# Altium schematic sheet IMUs.SchDoc
size A; SheetNumber: 10; SheetTotal: 11
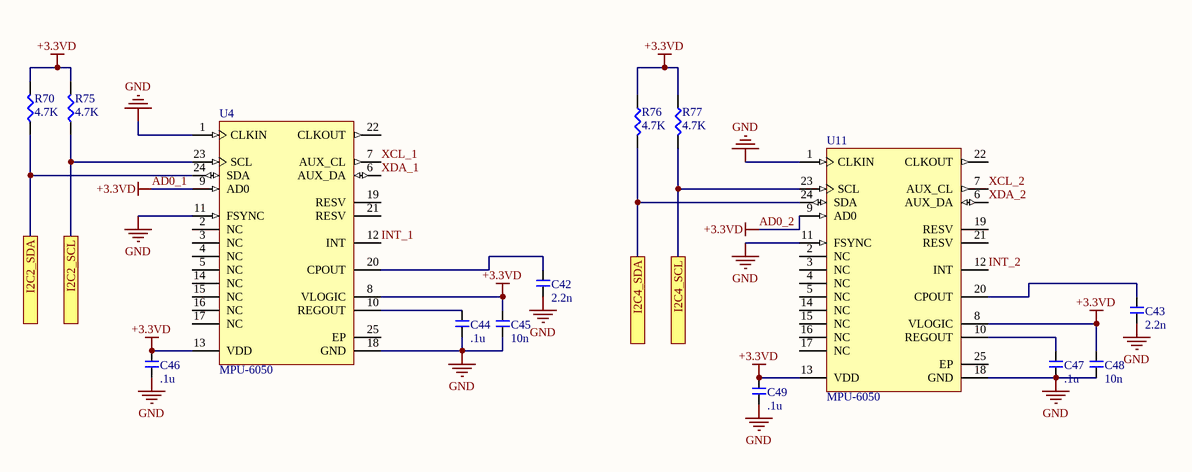
[diagram p0: IMUs.SchDoc]

## Parts
C42  2.2n  [CAP-0603]
C43  2.2n  [CAP-0603]
C44  .1u  [CAP-0603]
C45  10n  [CAP-0603]
C46  .1u  [CAP-0603]
C47  .1u  [CAP-0603]
C48  10n  [CAP-0603]
C49  .1u  [CAP-0603]
R70  4.7K  [RES-0603]
R75  4.7K  [RES-0603]
R76  4.7K  [RES-0603]
R77  4.7K  [RES-0603]
U4  MPU-6050  [IS-QFN-24_V]
U11  MPU-6050  [IS-QFN-24_V]

## Ports
I2C2_SCL, I2C2_SDA, I2C4_SCL, I2C4_SDA

## Nets
AD0_1: C45.2 C46.2 C48.2 C49.2 R70.2 R75.2 R76.1 R77.1 U4.8(VLOGIC) U4.9(AD0) U4.13(VDD) U11.8(VLOGIC) U11.9(AD0) U11.13(VDD)  [also labelled +3.3VD, AD0_2]
GND: C42.1 C43.1 C44.1 C45.1 C46.1 C47.1 C48.1 C49.1 U4.1(CLKIN) U4.11(FSYNC) U4.18(GND) U11.1(CLKIN) U11.11(FSYNC) U11.18(GND)
I2C2_SCL: R75.1 U4.23(SCL) ; port I2C2_SCL
I2C2_SDA: R70.1 U4.24(SDA) ; port I2C2_SDA
I2C4_SCL: R77.2 U11.23(SCL) ; port I2C4_SCL
I2C4_SDA: R76.2 U11.24(SDA) ; port I2C4_SDA
INT_1: U4.12(INT)
INT_2: U11.12(INT)
XCL_1: U4.7(AUX_CL)
XCL_2: U11.7(AUX_CL)
XDA_1: U4.6(AUX_DA)
XDA_2: U11.6(AUX_DA)
NetC42_2: C42.2 U4.20(CPOUT)
NetC43_2: C43.2 U11.20(CPOUT)
NetC44_2: C44.2 U4.10(REGOUT)
NetC47_2: C47.2 U11.10(REGOUT)

Not connected (* = marked no-connect by the designer): U4 2(NC) 3(NC) 4(NC) 5(NC) 14(NC) 15(NC) 16(NC) 17(NC) 19(RESV) 21(RESV) 22(CLKOUT) 25(EP); U11 2(NC) 3(NC) 4(NC) 5(NC) 14(NC) 15(NC) 16(NC) 17(NC) 19(RESV) 21(RESV) 22(CLKOUT) 25(EP)

## Library data of the parts
C42-C49 = CAP-0603
R70 R75-R77 = RES-0603
U4 U11 = CMP-1753-00002-2: 3-Axis Gyroscope, Accelerometer and a Digital Motion Processor(TM) (DMP), 2.375 to 3.46 V, -40 to 85 degC, 24-Pin QFN, RoHS, Tape and Reel; Manufacturer: InvenSense; Featured Product: MPU-60506-Axis,IntegratedI²CSolution; Other Names: 1428-1007-2 / MPU6050; Sensor Type: MotionTracking; Online Catalog: MPU-6000™Series; Unit PriceUSD: Digital; Datasheet Version: Rev. 3.3, 05/2012; Category: Sensors,Transducers; Datasheet URL: http://datasheet.octopart.com/MPU-6050-InvenSense-datasheet-14421344.pdf; Family: Multifunction; Standard Package: 5,000; Manufacturer URL: http://www.invensense.com/; Output Type: Digital; Dynamic Catalog: MPU-6000™Series